# Altium schematic sheet 15_HD_PUMP.SchDoc
size 420 x 297 mm; SheetNumber: 15; SheetTotal: 27
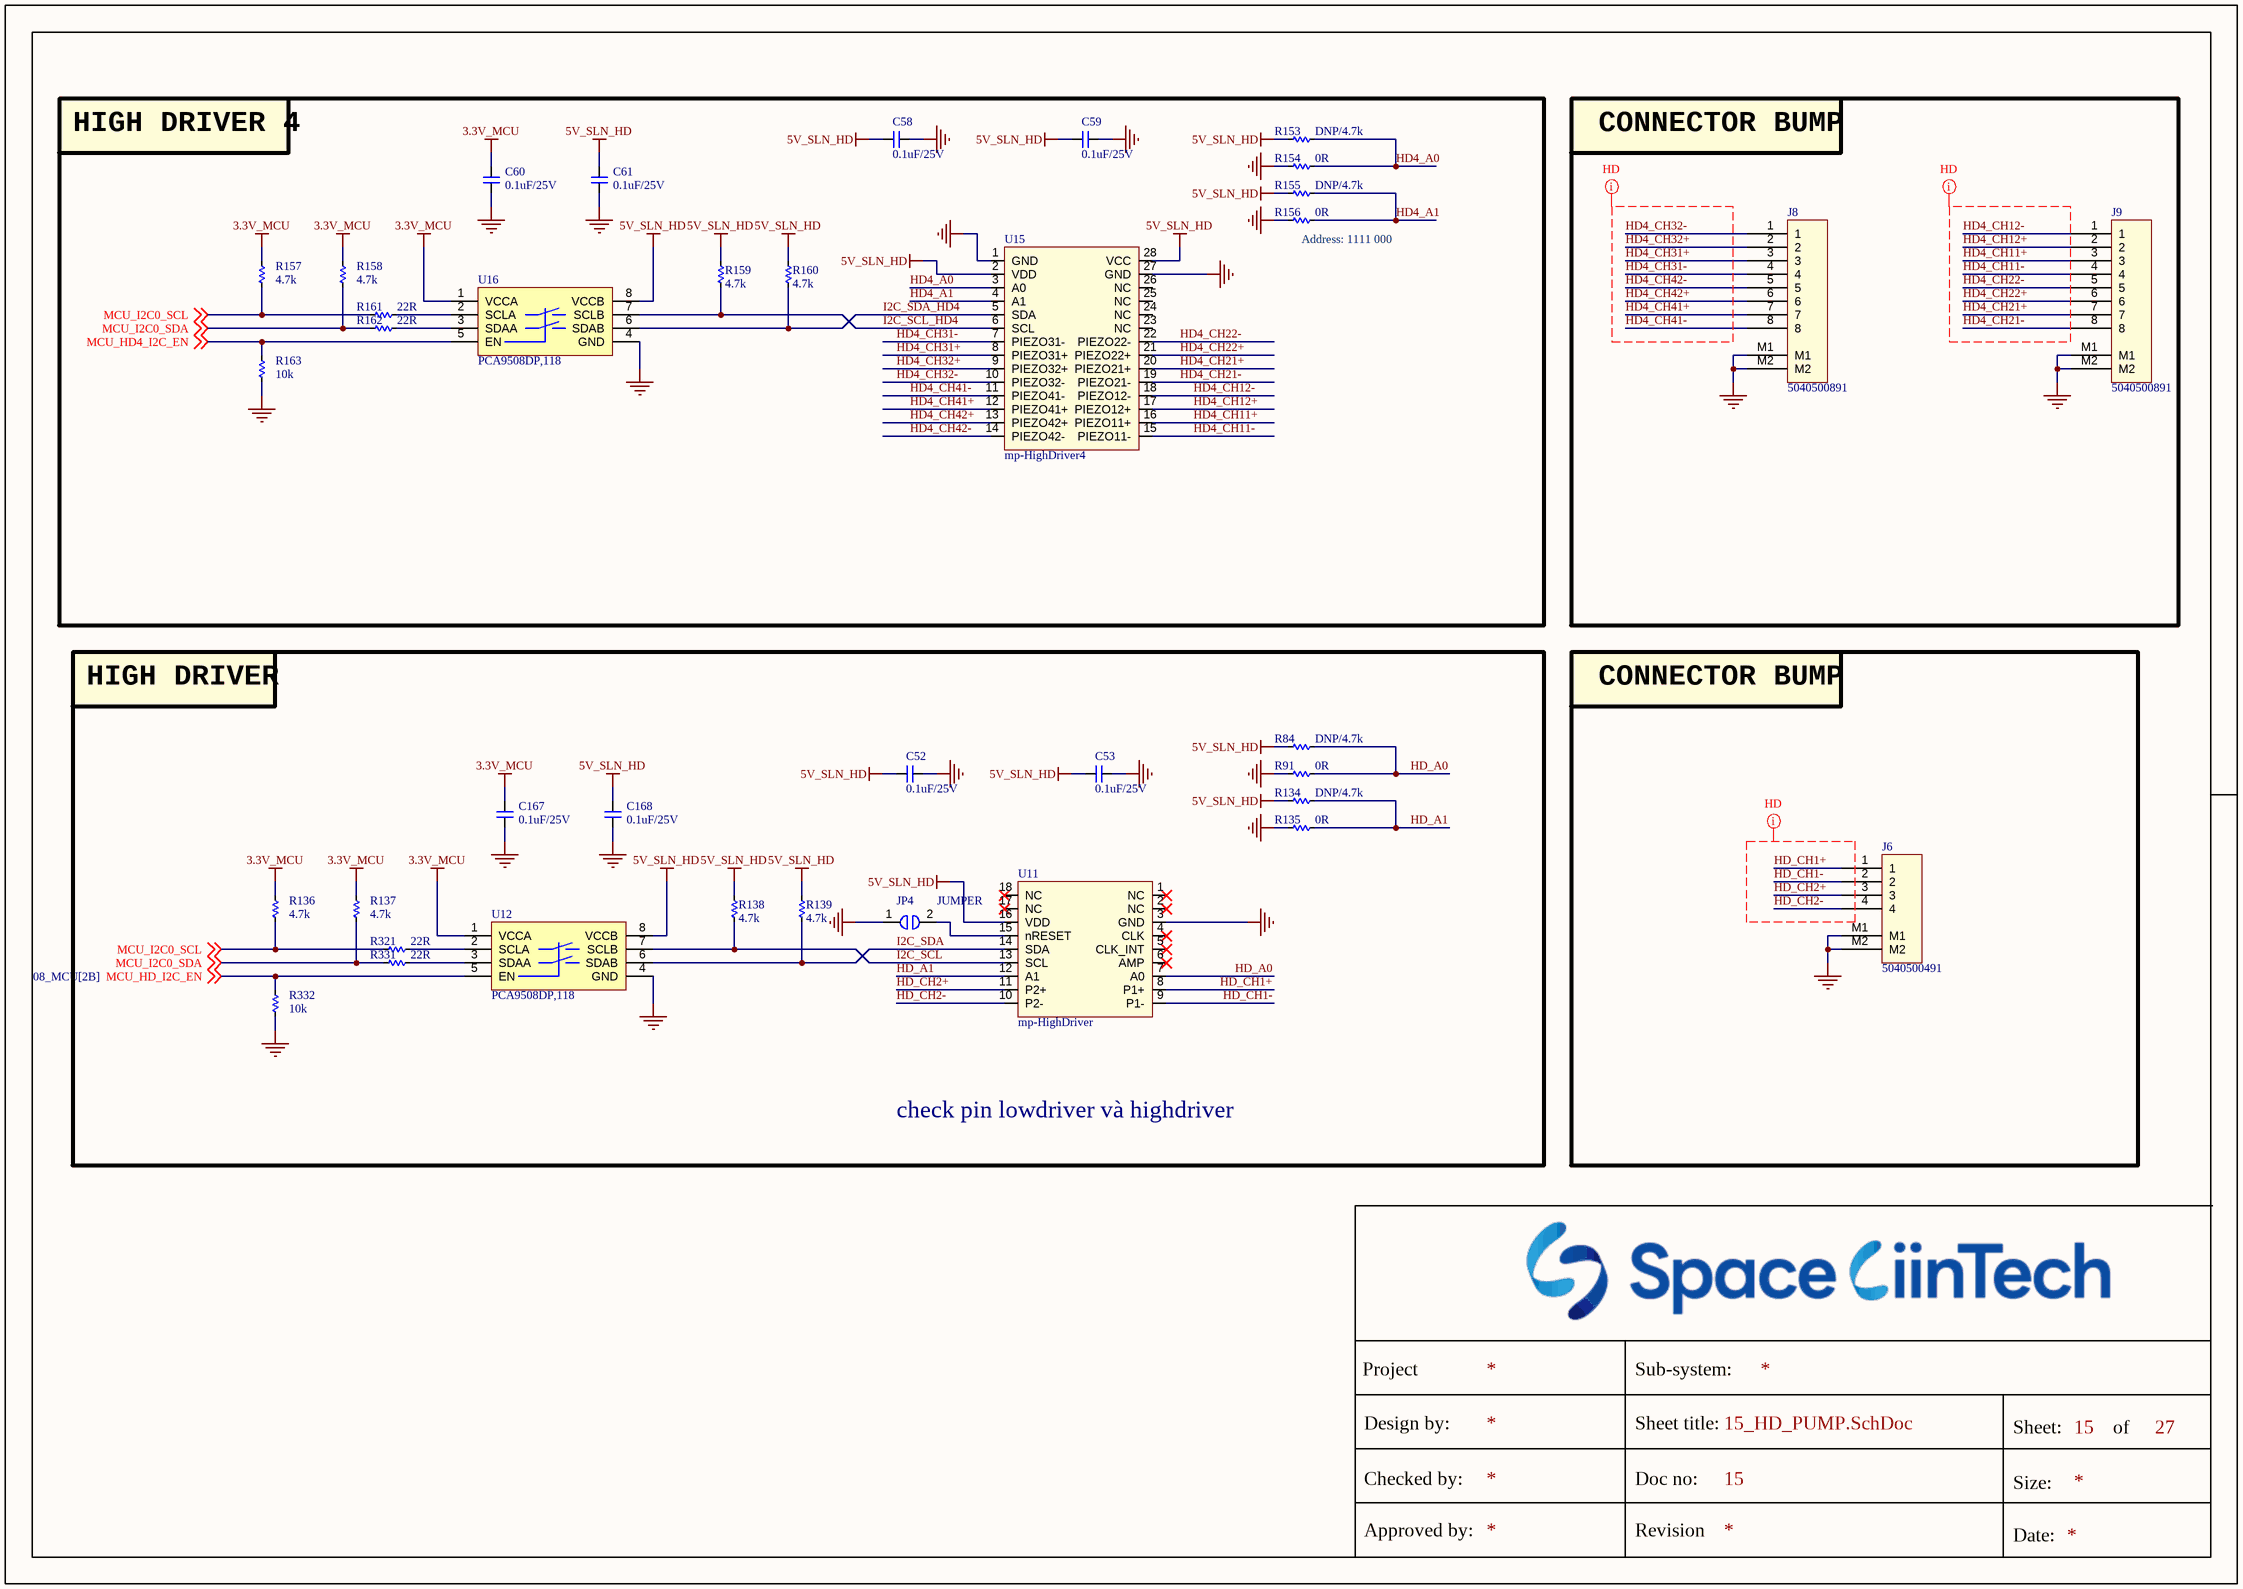
[diagram p0: 15_HD_PUMP.SchDoc]

## Parts
C52  0.1uF/25V  [CAP_C_1005X60]
C53  0.1uF/25V  [CAP_C_1005X60]
C58  0.1uF/25V  [CAP_C_1005X60]
C59  0.1uF/25V  [CAP_C_1005X60]
C60  0.1uF/25V  [CAP_C_1005X60]
C61  0.1uF/25V  [CAP_C_1005X60]
C167  0.1uF/25V  [CAP_C_1005X60]
C168  0.1uF/25V  [CAP_C_1005X60]
J6  5040500491  [MOLEX_5040500491]
J8  5040500891  [MOLEX_5040500891]
J9  5040500891  [MOLEX_5040500891]
JP4  JUMPER  [JUMPER_1608]
R84  DNP/4.7k  [RES_C_1005X40]
R91  0R  [RES_C_1005X40]
R134  DNP/4.7k  [RES_C_1005X40]
R135  0R  [RES_C_1005X40]
R136  4.7k  [RES_C_1005X40]
R137  4.7k  [RES_C_1005X40]
R138  4.7k  [RES_C_1005X40]
R139  4.7k  [RES_C_1005X40]
R153  DNP/4.7k  [RES_C_1005X40]
R154  0R  [RES_C_1005X40]
R155  DNP/4.7k  [RES_C_1005X40]
R156  0R  [RES_C_1005X40]
R157  4.7k  [RES_C_1005X40]
R158  4.7k  [RES_C_1005X40]
R159  4.7k  [RES_C_1005X40]
R160  4.7k  [RES_C_1005X40]
R161  22R  [RES_C_1005X40]
R162  22R  [RES_C_1005X40]
R163  10k  [RES_C_1005X40]
R321  22R  [RES_C_1005X40]
R331  22R  [RES_C_1005X40]
R332  10k  [RES_C_1005X40]
U11  mp-HighDriver  [MP_HIGHDRIVER]
U12  PCA9508DP,118  [TSOP8]
U15  mp-HighDriver4  [MP_HIGHDRIVER4]
U16  PCA9508DP,118  [TSOP8]

## Blocks framed on the sheet
HIGH DRIVER 4: C58-C61 R153-R163 U15 U16
CONNECTOR BUMP: J8 J9
HIGH DRIVER: C52 C53 C167 C168 JP4 R84 R91 R134-R139 R321 R331 R332 U11 U12
CONNECTOR BUMP: J6

## Nets
3.3V_MCU: C60.2 C167.2 R136.1 R137.1 R157.1 R158.1 U12.1(VCCA) U16.1(VCCA)
5V_SLN_HD: C52.2 C53.2 C58.2 C59.2 C61.2 C168.2 R84.1 R134.1 R138.1 R139.1 R153.1 R155.1 R159.1 R160.1 U11.16(VDD) U12.8(VCCB) U15.2(VDD) U15.28(VCC) U16.8(VCCB)
GND: C52.1 C53.1 C58.1 C59.1 C60.1 C61.1 C167.1 C168.1 J6.M1 J6.M2 J8.M1 J8.M2 J9.M1 J9.M2 JP4.1 R91.1 R135.1 R154.1 R156.1 R163.2 R332.2 U11.3(GND) U12.4(GND) U15.1(GND) U15.27(GND) U16.4(GND)
HD4_A0: R153.2 R154.2 U15.3(A0)
HD4_A1: R155.2 R156.2 U15.4(A1)
HD4_CH11+: J9.3 U15.16(PIEZO11+)
HD4_CH11-: J9.4 U15.15(PIEZO11-)
HD4_CH12+: J9.2 U15.17(PIEZO12+)
HD4_CH12-: J9.1 U15.18(PIEZO12-)
HD4_CH21+: J9.7 U15.20(PIEZO21+)
HD4_CH21-: J9.8 U15.19(PIEZO21-)
HD4_CH22+: J9.6 U15.21(PIEZO22+)
HD4_CH22-: J9.5 U15.22(PIEZO22-)
HD4_CH31+: J8.3 U15.8(PIEZO31+)
HD4_CH31-: J8.4 U15.7(PIEZO31-)
HD4_CH32+: J8.2 U15.9(PIEZO32+)
HD4_CH32-: J8.1 U15.10(PIEZO32-)
HD4_CH41+: J8.7 U15.12(PIEZO41+)
HD4_CH41-: J8.8 U15.11(PIEZO41-)
HD4_CH42+: J8.6 U15.13(PIEZO42+)
HD4_CH42-: J8.5 U15.14(PIEZO42-)
HD_A0: R84.2 R91.2 U11.7(A0)
HD_A1: R134.2 R135.2 U11.12(A1)
HD_CH1+: J6.1 U11.8(P1+)
HD_CH1-: J6.2 U11.9(P1-)
HD_CH2+: J6.3 U11.11(P2+)
HD_CH2-: J6.4 U11.10(P2-)
I2C_SCL: R138.2 U11.13(SCL) U12.7(SCLB)
I2C_SCL_HD4: R159.2 U15.6(SCL) U16.7(SCLB)
I2C_SDA: R139.2 U11.14(SDA) U12.6(SDAB)
I2C_SDA_HD4: R160.2 U15.5(SDA) U16.6(SDAB)
MCU_HD4_I2C_EN: R163.1 U16.5(EN) ; off-sheet MCU_HD4_I2C_EN
MCU_HD_I2C_EN: R332.1 U12.5(EN) ; off-sheet MCU_HD_I2C_EN
MCU_I2C0_SCL: R136.2 R157.2 R161.1 R321.1 ; off-sheet MCU_I2C0_SCL
MCU_I2C0_SDA: R137.2 R158.2 R162.1 R331.1 ; off-sheet MCU_I2C0_SDA
NetJP4_2: JP4.2 U11.15(nRESET)
NetR161_2: R161.2 U16.2(SCLA)
NetR162_2: R162.2 U16.3(SDAA)
NetR321_2: R321.2 U12.2(SCLA)
NetR331_2: R331.2 U12.3(SDAA)

Not connected (* = marked no-connect by the designer): U11 1(NC)* 2(NC)* 4(CLK)* 5(CLK_INT)* 6(AMP)* 17(NC)* 18(NC)*; U15 23(NC) 24(NC) 25(NC) 26(NC)

## Layout directives
net class HD: HD4_CH11+, HD4_CH11-, HD4_CH12+, HD4_CH12-, HD4_CH21+, HD4_CH21-, HD4_CH22+, HD4_CH22-, HD4_CH31+, HD4_CH31-, HD4_CH32+, HD4_CH32-, HD4_CH41+, HD4_CH41-, HD4_CH42+, HD4_CH42-, HD_CH1+, HD_CH1-, HD_CH2+, HD_CH2-

## Notes on the sheet
- (near R156) Address: 1111 000
- check pin lowdriver và highdriver
- Project
- Sub-system:
- Design by:
- Sheet title:
- Sheet:
- of
- Checked by:
- Approved by:
- Doc no:
- Revision
- Size:
- Date:

## Library data of the parts
C52 C53 C58-C61 C167 C168 = _CAP_C_2: CAP
J6 = Header 4x1_2M
J8 J9 = Header 8x1_2M
JP4 = JUMPER_1_1
R84 R91 R134-R139 R153-R163 R321 R331 R332 = _RES_B_2: RES
U15 = mp_HighDriver4